# EAGLE design 902_kerberos_105 (EAGLE 9.6.2)
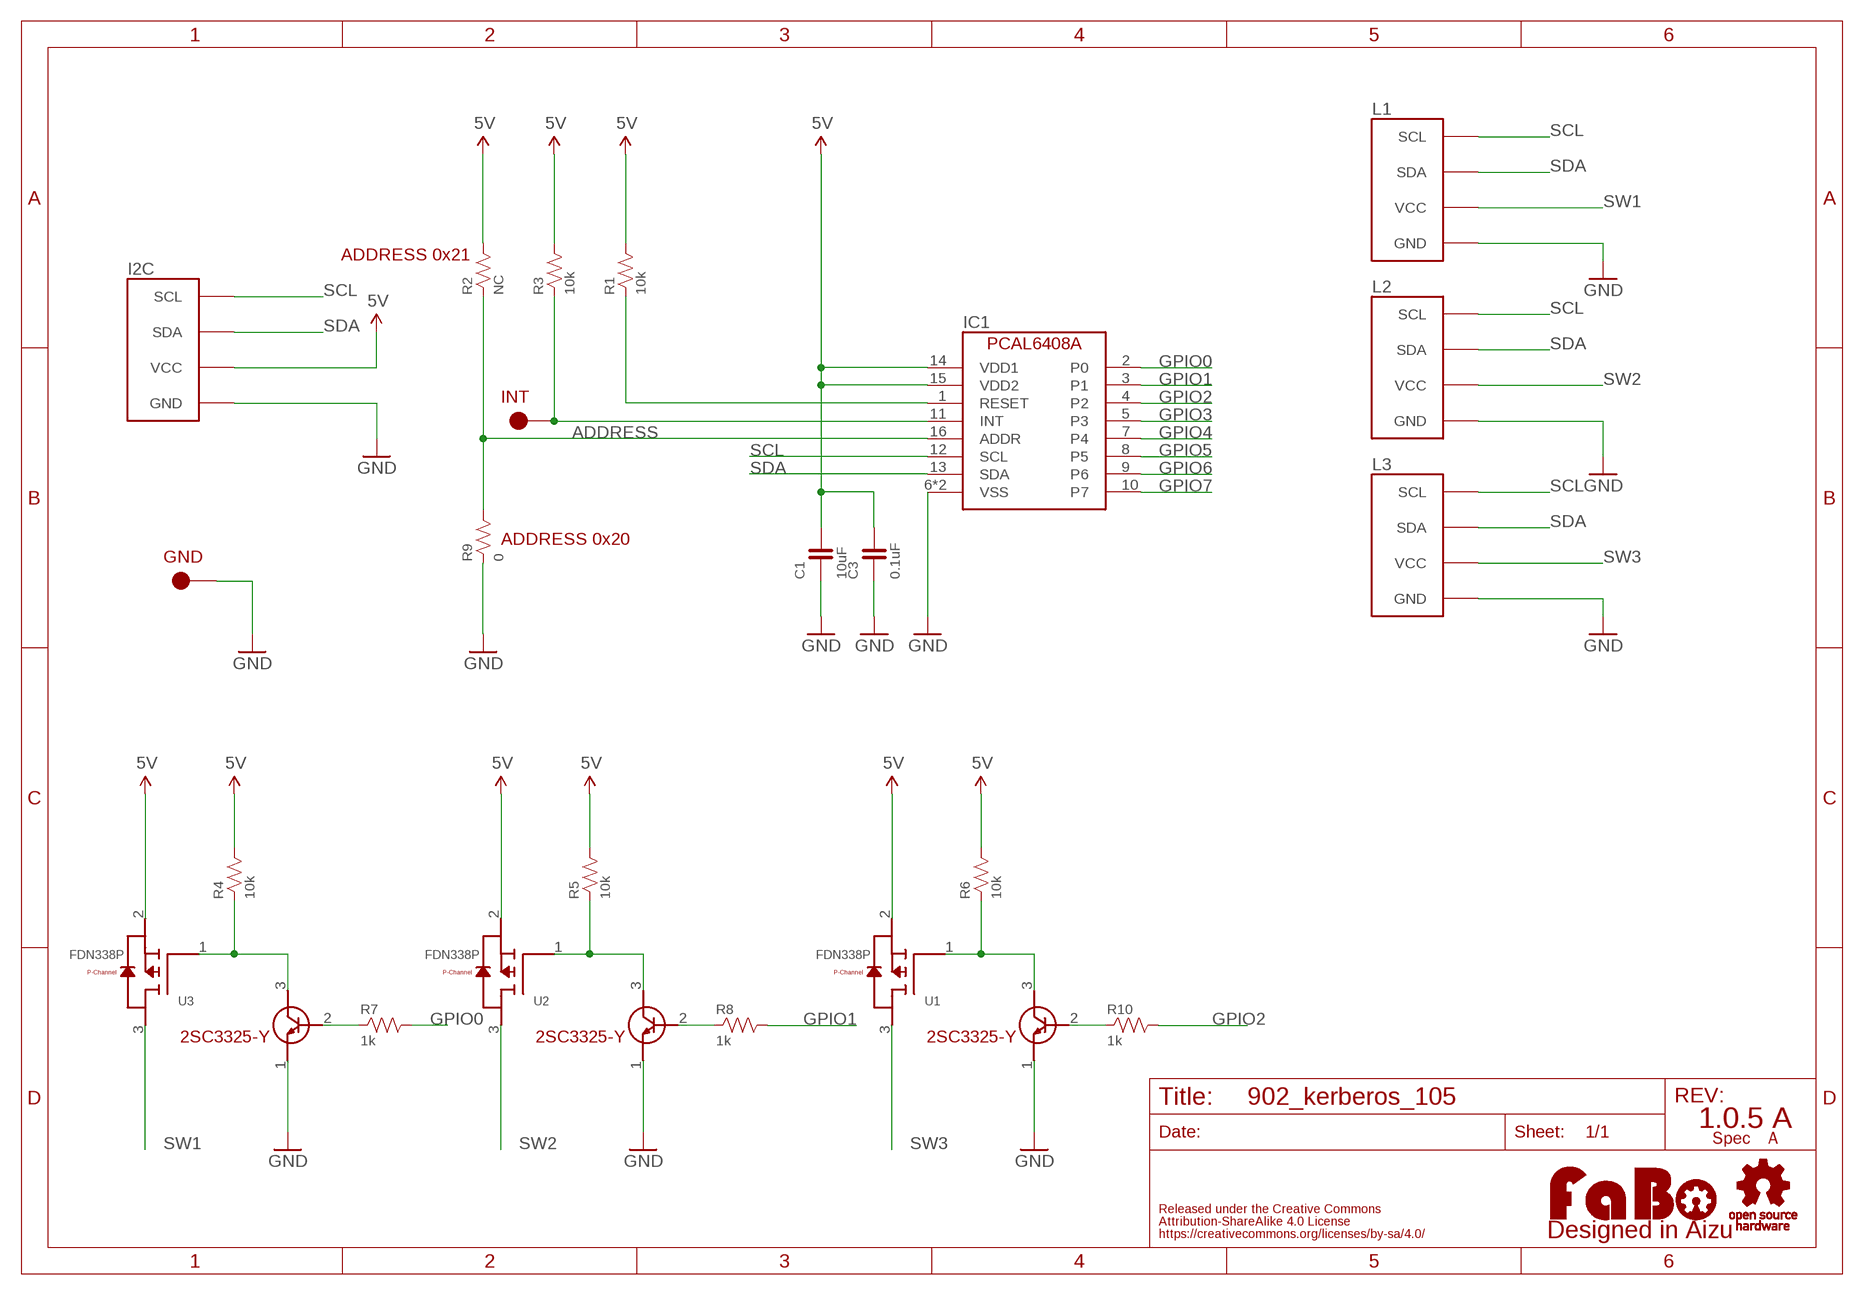
[diagram p0: schematic, sheet 1]

## Parts
C1  10uF  CAPACITOR-0603  [0603]
C3  0.1uF  CAPACITOR-0603  [0603]
I2C  FABO_BRICK_I2C-S04B-PASK-2  [FABO_BRICK_I2C_S04B-PASK-2]
IC1  NX-PCAL6408A  [NXP-PCAL6408A]
L1  FABO_BRICK_I2C-S04B-PASK-2  [FABO_BRICK_I2C_S04B-PASK-2]
L2  FABO_BRICK_I2C-S04B-PASK-2  [FABO_BRICK_I2C_S04B-PASK-2]
L3  FABO_BRICK_I2C-S04B-PASK-2  [FABO_BRICK_I2C_S04B-PASK-2]
R1  10k  RESISTOR-0603-NARROW  [0603-NARROW]
R2  NC  RESISTOR-0603-NARROW  [0603-NARROW]
R3  10k  RESISTOR-0603-NARROW  [0603-NARROW]
R4  10k  RESISTOR-0603-NARROW  [0603-NARROW]
R5  10k  RESISTOR-0603-NARROW  [0603-NARROW]
R6  10k  RESISTOR-0603-NARROW  [0603-NARROW]
R7  1k  RESISTOR-0603-NARROW  [0603-NARROW]
R8  1k  RESISTOR-0603-NARROW  [0603-NARROW]
R9  0  RESISTOR-0603-NARROW  [0603-NARROW]
R10  1k  RESISTOR-0603-NARROW  [0603-NARROW]
TP1  TP-15  [TP-15]
TP2  TP-15  [TP-15]
U1  FDN338P  [SOT-23]
U2  FDN338P  [SOT-23]
U3  FDN338P  [SOT-23]
U5  2SC3325-Y  [SC-59]
U6  2SC3325-Y  [SC-59]
U7  2SC3325-Y  [SC-59]
U$2  LOGO_OSHW-M  [LOGO_OSHW_M]
U$3  LOGO_FABO-M  [LOGO_FABO_MS]

## Nets
5V: C1.2 C3.2 I2C.VCC IC1.14(VDD1) IC1.15(VDD2) R1.2 R2.2 R3.2 R4.2 R5.2 R6.2 U1.2(S) U2.2(S) U3.2(S)
ADDRESS: IC1.16(ADDR) R2.1 R9.2
GND: C1.1 C3.1 I2C.GND IC1.6(VSS) IC1.17(VSS) L1.GND L2.GND L3.GND R9.1 TP2.1 U5.1(E) U6.1(E) U7.1(E)
GPIO0: IC1.2(P0) R7.2
GPIO1: IC1.3(P1) R8.2
GPIO2: IC1.4(P2) R10.2
GPIO3: IC1.5(P3)
GPIO4: IC1.7(P4)
GPIO5: IC1.8(P5)
GPIO6: IC1.9(P6)
GPIO7: IC1.10(P7)
N$1: IC1.1(RESET) R1.1
N$3: IC1.11(INT) R3.1 TP1.1
N$4: R4.1 U3.1(G) U7.3(C)
N$5: R5.1 U2.1(G) U5.3(C)
N$6: R7.1 U7.2(B)
N$7: R8.1 U5.2(B)
N$8: R6.1 U1.1(G) U6.3(C)
N$9: R10.1 U6.2(B)
SCL: I2C.SCL IC1.12(SCL) L1.SCL L2.SCL L3.SCL
SDA: I2C.SDA IC1.13(SDA) L1.SDA L2.SDA L3.SDA
SW1: L1.VCC U3.3(D)
SW2: L2.VCC U2.3(D)
SW3: L3.VCC U1.3(D)

## Notes on the sheet
- ADDRESS 0x21
- INT
- ADDRESS 0x20
- GND
- 1.0.5 A
- Spec　A

## Library data of the parts
C1 C3 = FaBo-Capacitor:CAPACITOR: CAPACITOR
I2C L1-L3 = FaBo-Template:FABO_BRICK_I2C: FaBo Brick I2C
IC1 = FaBo-Mems:NX-PCAL6408A: NXP PCAL6408A
R1-R10 = FaBo-Resistors:RESISTOR: RESISTOR
TP1 TP2 = FaBo-Supply:TP
U1-U3 = FaBo-Mosfet2:FDN338P
U5-U7 = FaBo-Transistor:2SC3325-Y
U$2 = FaBo-Logo:LOGO_OSHW
U$3 = FaBo-Logo:LOGO_FABO

## Board
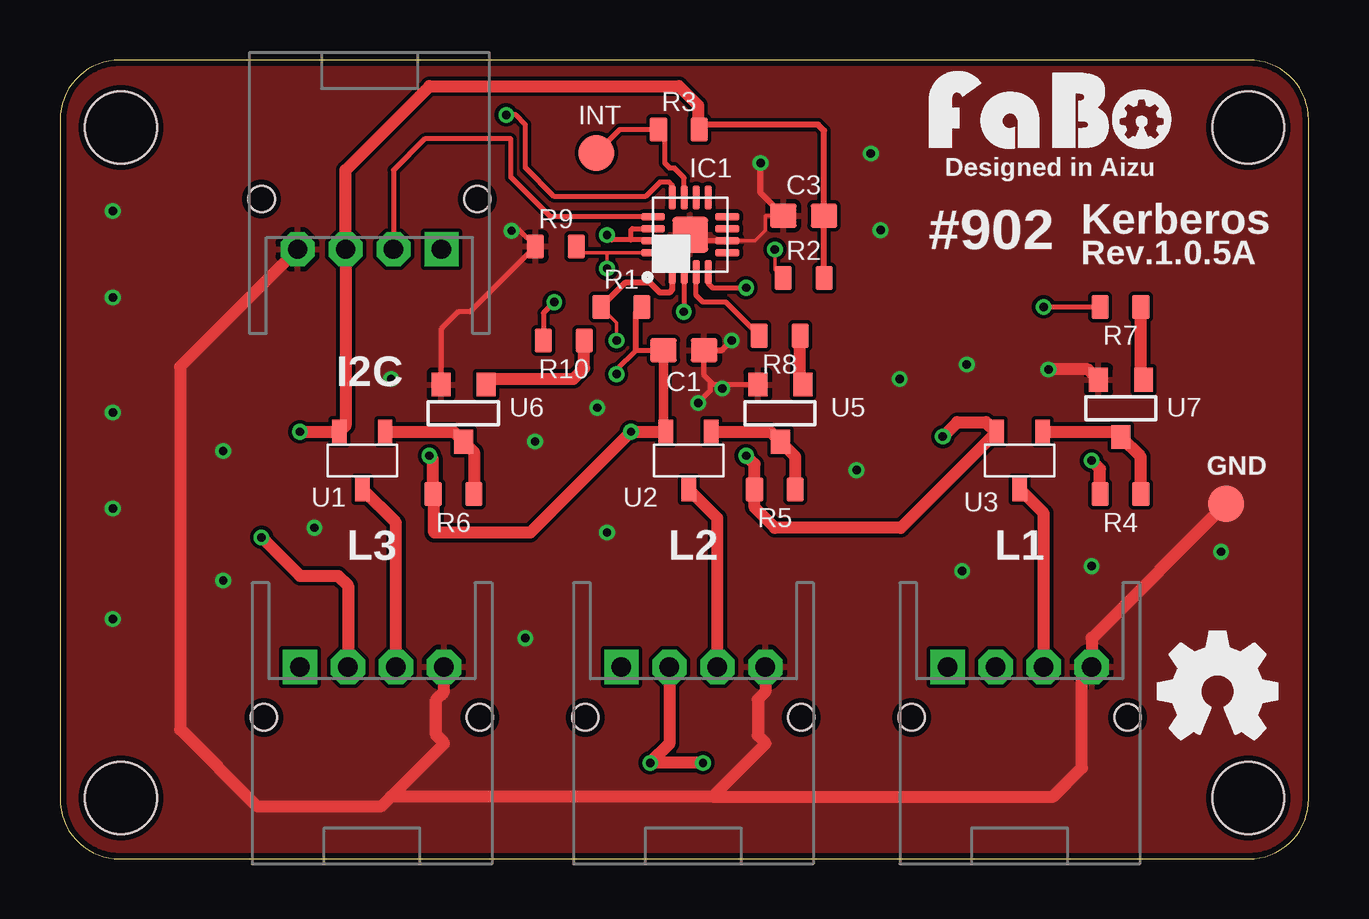
[diagram p1: board, top side]
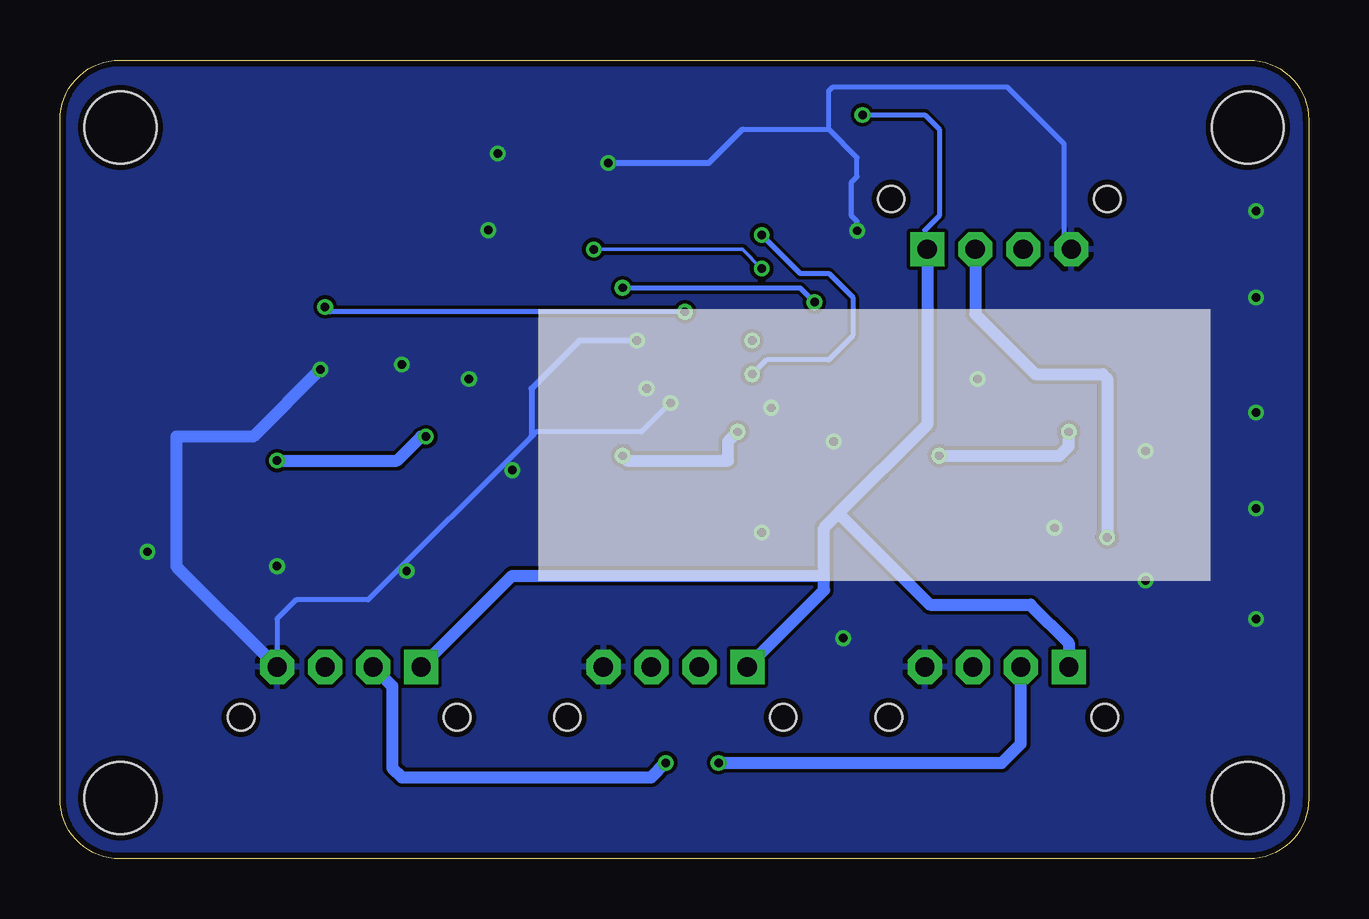
[diagram p2: board, bottom side, seen from below]

Size 52.05 x 33.29 mm. Coordinates in mm from the lower left corner, seen from the top.
Outline: 2.5,0 49.55,0 arc90 52.05,2.5 52.05,30.79 arc90 49.55,33.29 2.5,33.29 arc90 0,30.79 0,2.5 arc90 2.5,0
Copper layers (1*16): Top 0.035mm / dielectric 1.6mm / Bottom 0.035mm
Design rules "PCBway": minimum track width 6mil, minimum drill 12mil, track to track 6mil, track to pad 6mil, pad to pad 6mil, via to via 6mil, smd to smd 6mil, copper to edge 10mil, drill to drill 10mil, minimum pad ring 10mil, minimum via ring 6mil, stop-mask expansion 2mil, vias tented up to drill 100mil, thermal gap 8mil
Holes 3 mm at 2.54,30.48 49.53,30.48 49.53,2.54 2.54,2.54

### Footprints (pad centres in the part's own frame; a part is rotated, then mirrored left to right if it is on the bottom)
0603 = smd 1.1 x 1: 1 -0.85,0; 2 0.85,0
FABO_BRICK_I2C_S04B-PASK-2 = drill 0.8 pad 1.422 octagon: GND -3,0; SDA 1,0; VCC -1,0 | drill 0.8 pad 1.422 square: SCL 3,0 | hole 1.1: 4.5,2.1; -4.5,2.1
NXP-PCAL6408A = smd 1 x 0.3: 1 -1.55,0.75; 2 -1.55,0.25; 3 -1.55,-0.25; 4 -1.55,-0.75; 9 1.55,-0.75; 10 1.55,-0.25; 11 1.55,0.25; 12 1.55,0.75 | smd 0.3 x 1: 5 -0.75,-1.55; 6 -0.25,-1.55; 7 0.25,-1.55; 8 0.75,-1.55; 13 0.75,1.55; 14 0.25,1.55; 15 -0.25,1.55; 16 -0.75,1.55 | smd 1.5 x 1.5: 17 0,0
0603-NARROW = smd 0.71 x 1: 1 -0.85,0; 2 0.85,0
TP-15 = smd 1.5 x 1.5: 1 0,0
SOT-23 = smd 0.6 x 1: 1 -0.95,-1.2; 2 0.95,-1.2; 3 0,1.2
SC-59 = smd 0.787 x 0.991: 1 -0.914,1.168; 2 0.965,1.168; 3 0.025,-1.219

### Placement (x,y rotation side)
C1  26,21.2 180 top
C3  31,26.8 0 top
I2C  12.9,25.4 0 top
IC1  26.27,26.01 90 top
L1  40,8 180 top
L2  26.4,8 180 top
L3  13,8 180 top
R1  23.4,23 0 top
R2  31,24.2 0 top
R3  25.8,30.4 0 top
R4  44.2,15.2 180 top
R5  29.8,15.4 180 top
R6  16.4,15.2 180 top
R7  44.2,23 180 top
R8  30,21.8 180 top
R9  20.67,25.52 0 top
R10  21,21.6 180 top
TP1  22.36,29.42 0 top
TP2  48.6,14.8 0 top
U1  12.6,16.6 180 top
U2  26.2,16.6 180 top
U3  40,16.6 180 top
U5  30,18.6 0 top
U6  16.8,18.6 0 top
U7  44.2,18.8 0 top
U$2  48.26,6.99 0 top
U$3  41.27,29.21 0 top

### Tracks (layer width: path | path; a pad name or v marks a point on that pad's centre or on a via)
5V  (via drill 0.35)
  Top 0.2: IC1.15 24.68,25.8 23.8,25.8 | 23.8,25.8 23.8,26.2 23.86,26.26 IC1.14 | C1.2 24,21.2 23.2,20.4 v23.2,20.2 | 23.8,25.8 23,25.8 v22.8,26
  Top 0.254: 26.6,30.8 26.8,30.6 31.6,30.6 31.85,30.35 C3.2 R2.2 | 24,21.2 24,22.75 R1.2
  Top 0.4: U2.2 25.15,17.9 C1.2
  Top 0.5: v15.4,16.8 15.55,16.65 R6.2 15.6,15.15 15.6,13.6 19.6,13.6 v23.8,17.8 U2.2 | v10,17.8 U1.2 11.9,18.05 I2C.VCC 11.9,28.7 15.4,32.2 25.8,32.2 26.6,31.4 26.6,30.8 26.6,30.45 R3.2 | v28.6,16.8 28.95,16.45 R5.2 28.95,14.65 29.8,13.8 35.05,13.8 U3.2 39,17.8 38.6,18.2 37.4,18.2 v36.8,17.6 | R4.2 43.35,16.25 v43,16.6
  Bottom 0.2: v22.8,26 21.2,24.4 20,24.4 19,23.4 19,21.8 20,20.8 22.6,20.8 v23.2,20.2
  Bottom 0.5: v15.4,16.8 10.4,16.8 10,17.2 v10,17.8 | v28.6,16.8 28.4,16.6 24.2,16.6 24.2,17.4 v23.8,17.8 | v43,16.6 38,16.6 37,17.6 v36.8,17.6
ADDRESS  (via drill 0.35)
  Top 0.152: R2.1 29.8,24.55 v29.8,25.4 | v22.8,24.6 22.8,25.26 | 22.8,25.26 21.78,25.26 R9.2 | IC1.16 22.8,25.26
  Top 0.2: 21.78,25.26 R9.2
  Bottom 0.152: v29.8,25.4 23.6,25.4 v22.8,24.6
GND  (via drill 0.35)
  Top 0.152: 26.25,25.99 IC1.17 | C1.1 | C3.1 29.4,26.8 29.4,26.2 28.96,25.76 IC1.6
  Top 0.2: IC1.6 26.48,25.76 26.25,25.99 | 15.89,22 15.89,22.09 16.6,22.8 17.1,22.8 R9.1 19.14,26.2 18.8,26.2 v18.82,26.18 | 15.89,22 U6.1 | U5.1 27.23,19.77 27.1,19.9 | C1.1 26.85,20.15 27.1,19.9 | 15.89,22 | 27.1,19.9 27.1,19.5 v26.6,19
  Top 0.254: C1.1 27.6,21.2 v28,21.6 | C3.1 29.2,27.75 v29.2,29
  Top 0.5: I2C.GND 5,20.5 5,5.4 8.2,2.2 13.4,2.2 | 13.4,2.2 16,4.8 16,4.83 15.68,5.15 15.68,6.65 16,6.97 L3.GND | 27.2,2.6 29.4,4.8 29.4,4.83 29.08,5.15 29.08,6.65 29.4,6.97 L2.GND | 27.2,2.6 13.8,2.6 13.4,2.2 | 27.2,2.6 41.4,2.6 42.6,3.8 42.6,7.6 L1.GND 43,9.2 TP2.1 | U7.1 42.85,20.4 v41.2,20.4
  Bottom 0.2: 20,30.4 18.82,29.23 18.82,28.43 19.07,28.19 19.07,26.81 18.82,26.57 v18.82,26.18 | 20,30.4 20,32 19.83,32.17 12.57,32.17 10.2,29.8 10.2,25.7 I2C.GND | 23.6,30.4 20,30.4 | v26.6,19 27.8,17.8 32.2,17.8 32.4,17.6 39.2,10.8 42.2,10.8 43,10 L1.GND
  Bottom 0.254: v28,21.6 30.4,21.6 32.4,19.6 32.4,17.6 | v29.2,29 25,29 23.6,30.4
  Bottom 0.5: v41.2,20.4 44,17.6 47.2,17.6 47.2,12.2 L1.GND
  other vias: 2.2,27 2.2,23.4 2.2,18.6 2.2,14.6 2.2,10 6.8,11.6 6.8,17 10.6,13.8 13.8,20 19.8,17.4 19.4,9.2 22.8,13.6 33.2,16.2 27.6,19.6 22.4,18.8 35,20 37.8,20.6 33.8,29.4 34.2,26.2 37.6,12 43,12.2 48.4,12.8
  pour Top: 0,0 52.07,0 52.07,33.66 0,33.66
  pour Bottom: 0,0 52.07,0 52.07,33.66 0,33.66
GPIO0  (via drill 0.35)
  Top 0.2: IC1.2 26.02,22.82 v26,22.8 | v41,23 R7.2
  Bottom 0.2: v26,22.8 40.8,22.8 v41,23
GPIO1
  Top 0.2: IC1.3 26.52,23.48 26.8,23.2 27.75,23.2 28.88,22.07 29.07,21.88 R8.2
GPIO2  (via drill 0.35)
  Top 0.2: IC1.4 27.02,23.98 27.2,23.8 v28.6,23.8 | v20.6,23.2 20.15,22.75 R10.2
  Bottom 0.2: v28.6,23.8 21.2,23.8 v20.6,23.2
N$1  (via drill 0.35)
  Top 0.152: R1.1 23.2,22.35 v23.2,21.6
  Top 0.254: IC1.1 25.52,23.72 25.4,23.6 25,23.6 24.6,24 23.55,24 R1.1
N$3
  Top 0.2: TP1.1 23.34,30.4 R3.1 25.2,30.15 25.2,29 25.4,28.8 25.6,28.8 26.02,28.38 IC1.11
N$4
  Top 0.5: R4.1 45.05,16.76 U7.3 44.01,17.8 U3.1
N$5
  Top 0.5: R5.1 30.65,16.76 U5.3 29.61,17.8 U2.1
N$6
  Top 0.5: U7.2 45.05,20.08 R7.1
N$7
  Top 0.5: U5.2 30.85,19.88 R8.1
N$8
  Top 0.5: R6.1 17.25,16.96 U6.3 16.41,17.8 U1.1
N$9
  Top 0.5: U6.2 18,20 21.4,20 21.85,20.45 R10.1
SCL  (via drill 0.35)
  Top 0.2: IC1.12 25.52,28.08 25.4,28.2 25,28.2 24.4,27.6 20.6,27.6 19.4,28.8 19.4,30.6 19,31 v18.6,31
  Bottom 0.2: v18.6,31 16,31 15.4,30.4 15.4,26.8 16,26.2 16,25.5 I2C.SCL
  Bottom 0.5: I2C.SCL 15.9,18.1 19.6,14.4 | 19.6,14.4 15.8,10.6 11.6,10.6 10,9 L3.SCL | L2.SCL 20.2,11.2 20.2,11.8 | 20.2,11.8 20.2,13.8 19.6,14.4 | L1.SCL 33.2,11.8 20.2,11.8
SDA  (via drill 0.35)
  Top 0.2: IC1.13 20.44,26.76 18.8,28.4 18.8,30 15.2,30 13.9,28.7 I2C.SDA
  Top 0.5: v8.4,13.4 10,11.8 11.6,11.8 12,11.4 L3.SDA | L2.SDA 25.4,4.8 v24.6,4 v26.8,4
  Bottom 0.5: I2C.SDA 13.9,22.7 11.4,20.2 8.6,20.2 8.4,20 v8.4,13.4 | v24.6,4 12.8,4 12,4.8 L3.SDA | L1.SDA 38.2,7.2 38.2,3.8 37.8,3.4 27.4,3.4 v26.8,4
SW1
  Top 0.5: L1.VCC 41,14.4 U3.3
SW2
  Top 0.5: L2.VCC 27.4,14.2 U2.3
SW3
  Top 0.5: L3.VCC 14,14 U1.3

### Text on the board
tPlace: INT | Designed in Aizu | Kerberos | #902 | Rev.1.0.5A | GND